# EAGLE design SS (EAGLE 9.3.0)
REVISION: F
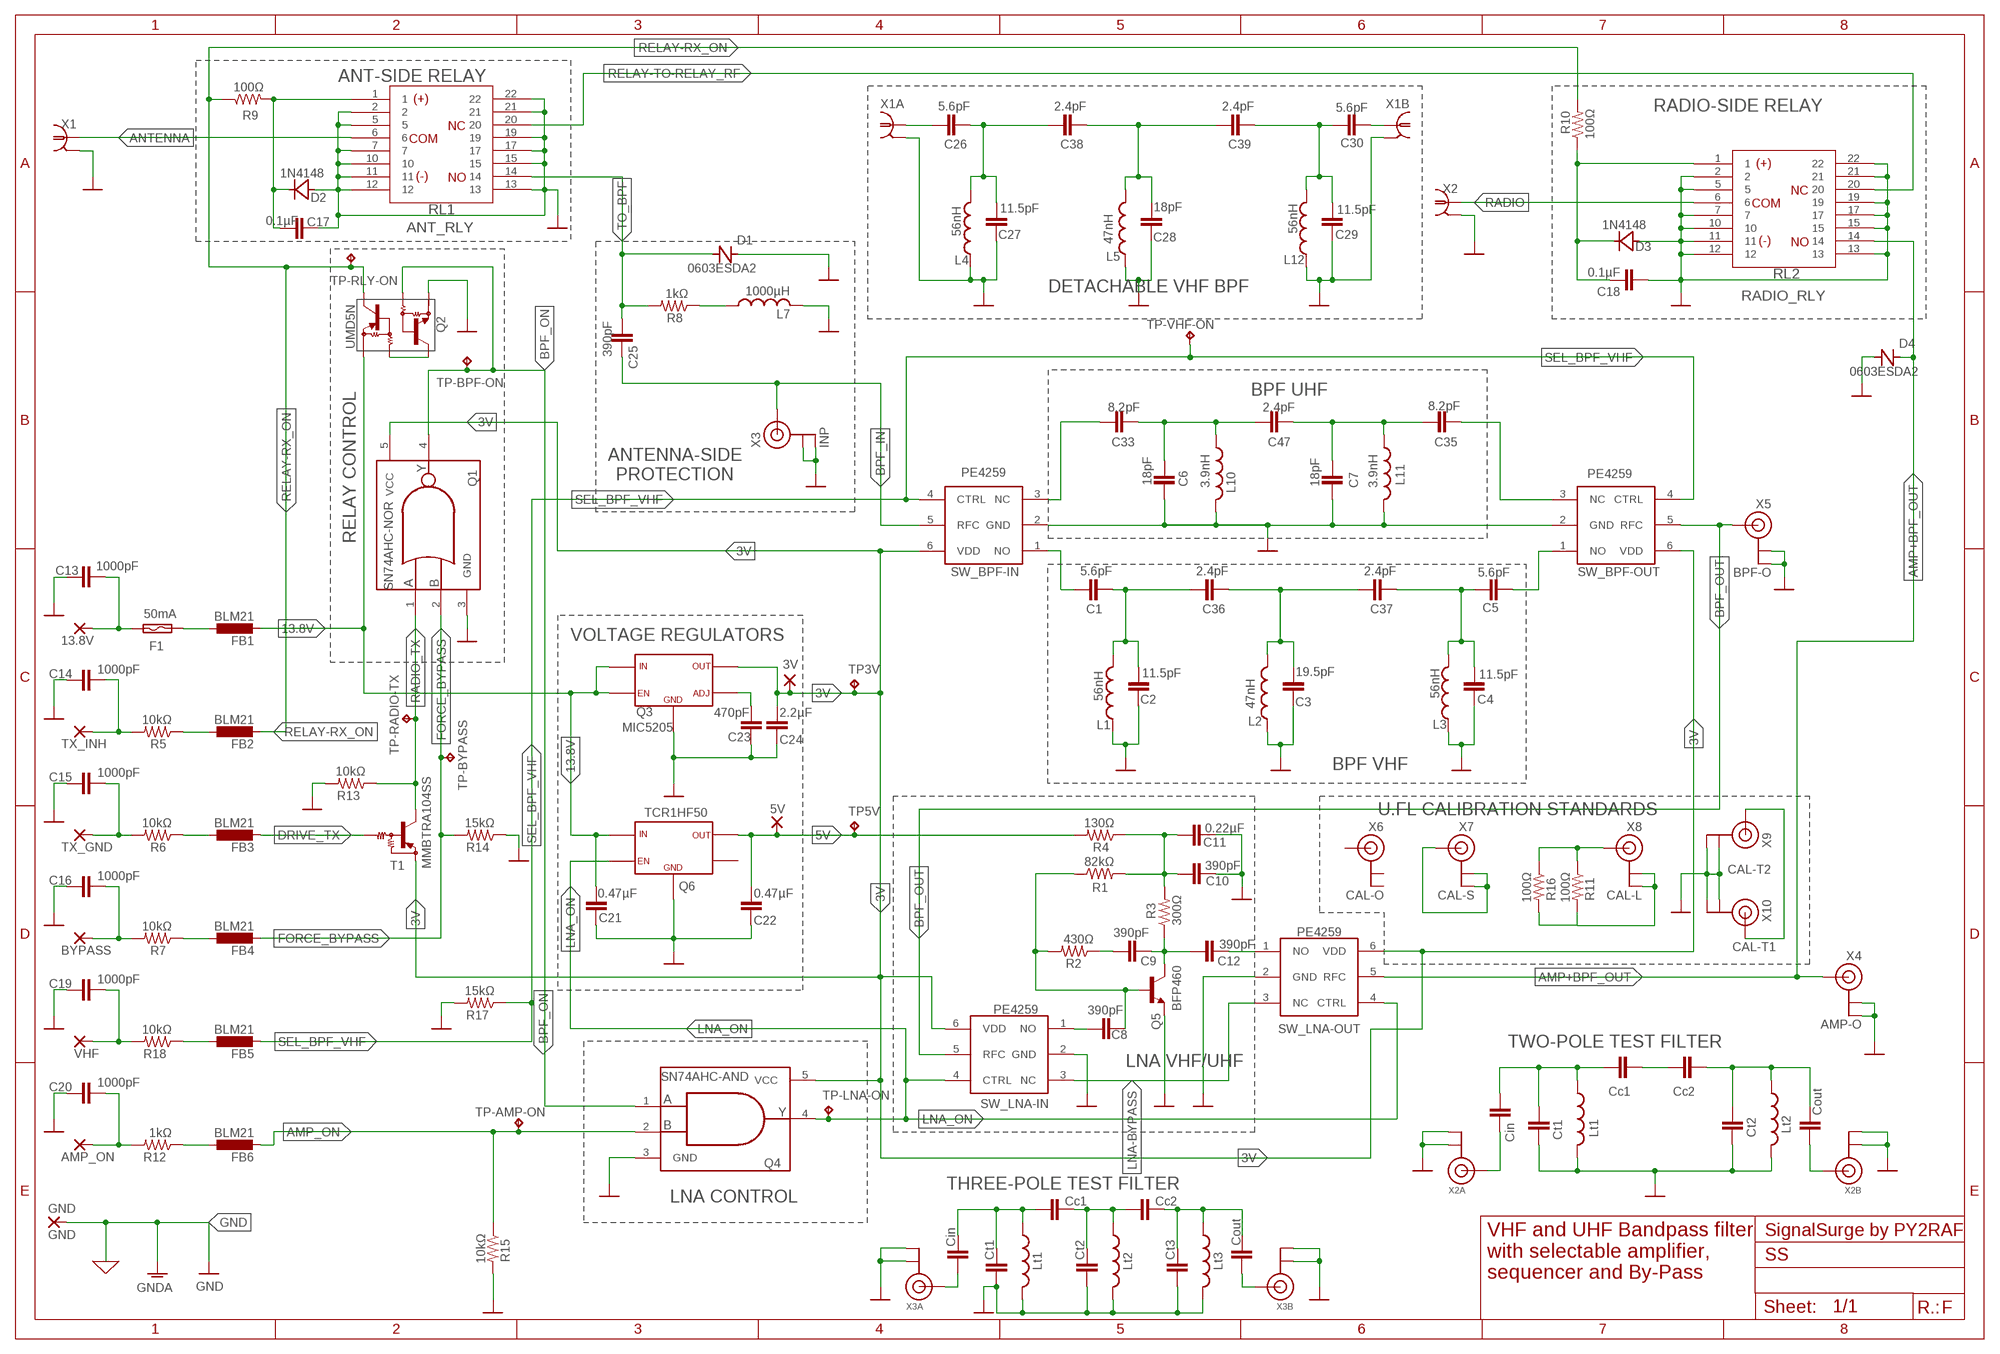
[diagram p0: schematic, sheet 1]

## Parts
3V  3V  JUMPER-1  [JUMPER1]
5V  5V  JUMPER-1  [JUMPER1]
13.8V  13.8V  JUMPER-1  [JUMPER1]
AMP_ON  AMP_ON  JUMPER-1  [JUMPER1]
BYPASS  BYPASS  JUMPER-1  [JUMPER1]
C1  5.6pF  C-0805  [0805]
C2  11.5pF  C-0805  [0805]
C3  19.5pF  C-0805  [0805]
C4  11.5pF  C-0805  [0805]
C5  5.6pF  C-0805  [0805]
C6  18pF  C-0805  [0805]
C7  18pF  C-0805  [0805]
C8  390pF  C-0805  [0805]
C9  390pF  C-0805  [0805]
C10  390pF  C-0805  [0805]
C11  0.22µF  C-0805  [0805]
C12  390pF  C-0805  [0805]
C13  1000pF  C-0805  [0805]
C14  1000pF  C-0805  [0805]
C15  1000pF  C-0805  [0805]
C16  1000pF  C-0805  [0805]
C17  0.1µF  C-0805  [0805]
C18  0.1µF  C-0805  [0805]
C19  1000pF  C-0805  [0805]
C20  1000pF  C-0805  [0805]
C21  0.47µF  C-0805  [0805]
C22  0.47µF  C-0805  [0805]
C23  470pF  C-0805  [0805]
C24  2.2µF  C-0805  [0805]
C25  390pF  C-0805  [0805]
C26  5.6pF  C-0805  [0805]
C27  11.5pF  C-0805  [0805]
C28  18pF  C-0805  [0805]
C29  11.5pF  C-0805  [0805]
C30  5.6pF  C-0805  [0805]
C31  Ct1  C-0805  [0805]
C32  Ct2  C-0805  [0805]
C33  8.2pF  C-0805  [0805]
C35  8.2pF  C-0805  [0805]
C36  2.4pF  C-0805  [0805]
C37  2.4pF  C-0805  [0805]
C38  2.4pF  C-0805  [0805]
C39  2.4pF  C-0805  [0805]
C40  Cin  C-0805  [0805]
C41  Ct1  C-0805  [0805]
C42  Cc1  C-0805  [0805]
C43  Ct2  C-0805  [0805]
C44  Cc2  C-0805  [0805]
C45  Ct3  C-0805  [0805]
C46  Cout  C-0805  [0805]
C47  2.4pF  C-0805  [0805]
D1  0603ESDA2  [0603]
D2  1N4148  D-SOD323  [SOD-323]
D3  1N4148  D-SOD323  [SOD-323]
D4  0603ESDA2  [0603]
F1  50mA  FUSE-1206  [FUSE-1206]
FB1  BLM21  FB-0805  [0805]
FB2  BLM21  FB-0805  [0805]
FB3  BLM21  FB-0805  [0805]
FB4  BLM21  FB-0805  [0805]
FB5  BLM21  FB-0805  [0805]
FB6  BLM21  FB-0805  [0805]
GND  GND  JUMPER-1  [JUMPER1]
L1  56nH  L-0805  [0805]
L2  47nH  L-0805  [0805]
L3  56nH  L-0805  [0805]
L4  56nH  L-0805  [0805]
L5  47nH  L-0805  [0805]
L6  Lt1  L-0805  [0805]
L7  1000µH  L-1207  [1207]
L8  Lt2  L-0805  [0805]
L9  Lt3  L-0805  [0805]
L10  3.9nH  L-0805  [0805]
L11  3.9nH  L-0805  [0805]
L12  56nH  L-0805  [0805]
L13  Cc2  C-0805  [0805]
L14  Cout  C-0805  [0805]
L15  Cin  C-0805  [0805]
L16  Lt1  L-0805  [0805]
L17  Lt2  L-0805  [0805]
L18  Cc1  C-0805  [0805]
Q1  SN74AHC-NOR  [SC70-5]
Q2  UMD5N  [SOT363]
Q3  MIC5205  [SOT23-5]
Q4  SN74AHC-AND  [SC70-5]
Q5  BFP460  [SOT343R]
Q6  TCR1HF50  TCR1HF  [SC-74A]
R1  82kΩ  R-1206  [1206]
R2  430Ω  R-1206  [1206]
R3  300Ω  R-1206  [1206]
R4  130Ω  R-1206  [1206]
R5  10kΩ  R-1206  [1206]
R6  10kΩ  R-1206  [1206]
R7  10kΩ  R-1206  [1206]
R8  1kΩ  R-1206  [1206]
R9  100Ω  R-1206  [1206]
R10  100Ω  R-1206  [1206]
R11  100Ω  R-1206  [1206]
R12  1kΩ  R-1206  [1206]
R13  10kΩ  R-1206  [1206]
R14  15kΩ  R-1206  [1206]
R15  10kΩ  R-1206  [1206]
R16  100Ω  R-1206  [1206]
R17  15kΩ  R-1206  [1206]
R18  10kΩ  R-1206  [1206]
RL1  ANT_RLY  RELAY-TE-HF3  [RELAY-TE-HF3]
RL2  RADIO_RLY  RELAY-TE-HF3  [RELAY-TE-HF3]
SW_BPF-IN  PE4259  [SC-70]
SW_BPF-OUT  PE4259  [SC-70]
SW_LNA-IN  PE4259  [SC-70]
SW_LNA-OUT  PE4259  [SC-70]
T1  MMBTRA104SS  MUN2111T1-PNP_DRIVER-SC59-BEC  [SC59-BEC]
TP3V  TPB1,27  [B1,27]
TP5V  TPB1,27  [B1,27]
TP-AMP-ON  TPB1,27  [B1,27]
TP-BPF-ON  TPB1,27  [B1,27]
TP-BYPASS  TPB1,27  [B1,27]
TP-LNA-ON  TPB1,27  [B1,27]
TP-RADIO-TX  TPB1,27  [B1,27]
TP-RLY-ON  TPB1,27  [B1,27]
TP-VHF-ON  TPB1,27  [B1,27]
TX_GND  TX_GND  JUMPER-1  [JUMPER1]
TX_INH  TX INH  JUMPER-1  [JUMPER1]
VHF  VHF  JUMPER-1  [JUMPER1]
X1  ANTENNA  SMA-PCB  [SMA-RF]
X1A  SMA-EDGE  [SMA-EDGE]
X1B  SMA-EDGE  [SMA-EDGE]
X2  RADIO  SMA-PCB  [SMA-RF]
X2A  ANTENNA_U.FL  [U.FL]
X2B  ANTENNA_U.FL  [U.FL]
X3  INP  ANTENNA_U.FL  [U.FL]
X3A  ANTENNA_U.FL  [U.FL]
X3B  ANTENNA_U.FL  [U.FL]
X4  AMP-O  ANTENNA_U.FL  [U.FL]
X5  BPF-O  ANTENNA_U.FL  [U.FL]
X6  CAL-O  ANTENNA_U.FL  [U.FL]
X7  CAL-S  ANTENNA_U.FL  [U.FL]
X8  CAL-L  ANTENNA_U.FL  [U.FL]
X9  CAL-T2  ANTENNA_U.FL  [U.FL]
X10  CAL-T1  ANTENNA_U.FL  [U.FL]

## Nets
3V: 3V.1(P) C24.P$2 Q1.5(VCC) Q3.5(VOUT) Q4.5(VCC) SW_BPF-IN.6(VDD) SW_BPF-OUT.6(VDD) SW_LNA-IN.6(VDD) SW_LNA-OUT.6(VDD) T1.E TP3V.TP
5V: 5V.1(P) C22.P$2 Q6.5(VOUT) R4.2 TP5V.TP
13.8V: C21.P$2 FB1.P$2 Q2.4 Q3.1(VIN) Q3.3(EN) Q6.1(VIN)
13.8V_IN: 13.8V.1(P) C13.P$2 F1.2
AMP+BPF_OUT [RF_50OHM]: D4.1(A) RL2.14 SW_LNA-OUT.5(RFC) X4.3(SIGNAL)
AMP_ON: FB6.P$2 Q4.2(B) R15.1 TP-AMP-ON.TP
AMP_ON_IN: AMP_ON.1(P) C20.P$2 R12.2
ANTENNA [TX_50OHM]: RL1.6 X1.1
BIAS_IN: C10.P$1 C11.P$1 R1.2 R3.2 R4.1
BLEED: L7.P$1 R8.1
BPF_IN [RF_50OHM]: C25.P$1 SW_BPF-IN.5(RFC) X3.3(SIGNAL)
BPF_ON: Q1.4(Y) Q2.2 Q4.1(A) TP-BPF-ON.TP
BPF_OUT [RF_50OHM]: SW_BPF-OUT.5(RFC) SW_LNA-IN.5(RFC) X5.3(SIGNAL)
BYPASS_SEL_IN: BYPASS.1(P) C16.P$2 R7.2
D-V-IN [RF_50OHM]: C30.P$2 X1B.P$3
D-V-OUT [RF_50OHM]: C26.P$2 X1A.P$3
D-V-P1 [RF_50OHM]: C26.P$1 C27.P$1 C38.P$2 L4.P$2
D-V-P2 [RF_50OHM]: C28.P$1 C38.P$1 C39.P$2 L5.P$2
D-V-P3 [RF_50OHM]: C29.P$1 C30.P$1 C39.P$1 L12.P$1
DRIVE_TX: FB3.P$2 T1.B
FEED-RA: C17.P$2 D2.C R9.2 RL1.1
FEED-RB: C18.P$1 D3.C R10.1 RL2.1
FORCE_BYPASS: FB4.P$2 Q1.2(B) R14.2 TP-BYPASS.TP
GND: C2.P$2 C3.P$2 C4.P$2 C6.P$1 C7.P$1 C10.P$2 C11.P$2 C13.P$1 C14.P$1 C15.P$1 C16.P$1 C17.P$1 C18.P$2 C19.P$1 C20.P$1 C21.P$1 C22.P$1 C23.P$1 C24.P$1 C27.P$2 C28.P$2 C29.P$2 C31.P$1 C32.P$1 C41.P$2 C43.P$2 C45.P$2 D1.1(A) D2.A D3.A D4.2(C) GND.1(P) L1.P$1 L2.P$1 L3.P$2 L4.P$1 L5.P$1 L6.P$2 L7.P$2 L8.P$2 L9.P$2 L10.P$2 L11.P$2 L12.P$2 L16.P$2 L17.P$2 Q1.3(GND) Q2.1 Q3.2(GND) Q4.3(GND) Q5.1(E) Q5.3(E) Q6.2(GND) R13.2 R14.1 R15.2 R17.2 RL1.2 RL1.5 RL1.7 RL1.10 RL1.11 RL1.12 RL1.13 RL1.15 RL1.17 RL1.19 RL1.21 RL1.22 RL2.2 RL2.5 RL2.7 RL2.10 RL2.11 RL2.12 RL2.13 RL2.15 RL2.17 RL2.19 RL2.21 RL2.22 SW_BPF-IN.2(GND) SW_BPF-OUT.2(GND) SW_LNA-IN.2(GND) SW_LNA-OUT.2(GND) X1.2 X1.3 X1.4 X1.5 X1A.P$1 X1A.P$2 X1A.P$4 X1A.P$5 X1A.P$6 X1A.P$7 X1B.P$1 X1B.P$2 X1B.P$4 X1B.P$5 X1B.P$6 X1B.P$7 X2.2 X2.3 X2.4 X2.5 X2A.1(GND) X2A.2(GND) X2B.1(GND) X2B.2(GND) X3.1(GND) X3.2(GND) X3A.1(GND) X3A.2(GND) X3B.1(GND) X3B.2(GND) X4.1(GND) X4.2(GND) X5.1(GND) X5.2(GND) X9.1(GND) X9.2(GND) X10.1(GND) X10.2(GND) ; supply symbol labelled GNDA
LNA-BYPASS [RF_50OHM]: SW_LNA-IN.3(NC) SW_LNA-OUT.3(NC)
LNA-IN: C8.P$2 Q5.4(B) R1.1 R2.2
LNA-OUT: C9.P$2 C12.P$1 Q5.2(C) R3.1
LNA_ON: Q4.4(Y) Q6.3(EN) SW_LNA-IN.4(CTRL) SW_LNA-OUT.4(CTRL) TP-LNA-ON.TP
N$1: C12.P$2 SW_LNA-OUT.1(NO)
N$3: C8.P$1 SW_LNA-IN.1(NO)
N$4: C23.P$2 Q3.4(ADJ-BYP)
N$5 [RF_50OHM]: L13.P$1 L18.P$2
N$6 [RF_50OHM]: L15.P$1 X2A.3(SIGNAL)
N$7: Q2.5 Q2.6
N$8 [RF_50OHM]: X7.1(GND) X7.2(GND) X7.3(SIGNAL)
N$9 [RF_50OHM]: R11.1 R16.1 X8.3(SIGNAL)
N$10: R11.2 R16.2 X8.1(GND) X8.2(GND)
N$11 [RF_50OHM]: L14.P$2 X2B.3(SIGNAL)
N$12: FB5.P$1 R18.1
N$13: F1.1 FB1.P$1
N$14 [RF_50OHM]: X9.3(SIGNAL) X10.3(SIGNAL)
N$22: C9.P$1 R2.1
N$27: FB2.P$1 R5.1
N$28: FB3.P$1 R6.1
N$32: FB4.P$1 R7.1
N$45: FB6.P$1 R12.1
RADIO [TX_50OHM]: RL2.6 X2.1
RADIO_TX: Q1.1(A) R13.1 T1.C TP-RADIO-TX.TP
RELAY-RX_ON: FB2.P$2 Q2.3 R9.1 R10.2 TP-RLY-ON.TP
RELAY-TO-RELAY_RF [TX_50OHM]: RL1.20 RL2.20
SEL_BPF_VHF: FB5.P$2 R17.1 SW_BPF-IN.4(CTRL) SW_BPF-OUT.4(CTRL) TP-VHF-ON.TP
T-U-IN [RF_50OHM]: C40.P$1 X3A.3(SIGNAL)
T-U-OUT [RF_50OHM]: C46.P$1 X3B.3(SIGNAL)
T-U-P1 [RF_50OHM]: C40.P$2 C41.P$1 C42.P$1 L6.P$1
T-U-P2 [RF_50OHM]: C42.P$2 C43.P$1 C44.P$1 L8.P$1
T-U-P3 [RF_50OHM]: C44.P$2 C45.P$1 C46.P$2 L9.P$1
T-V-P1 [RF_50OHM]: C31.P$2 L15.P$2 L16.P$1 L18.P$1
T-V-P2 [RF_50OHM]: C32.P$2 L13.P$2 L14.P$1 L17.P$1
TO_BPF [RF_50OHM]: C25.P$2 D1.2(C) R8.2 RL1.14
TX_GND_IN: C15.P$2 R6.2 TX_GND.1(P)
TX_INH_OUT: C14.P$2 R5.2 TX_INH.1(P)
UHF-IN [RF_50OHM]: C33.P$1 SW_BPF-IN.3(NC)
UHF-OUT [RF_50OHM]: C35.P$2 SW_BPF-OUT.3(NC)
UHF-P1 [RF_50OHM]: C6.P$2 C33.P$2 C47.P$1 L10.P$1
UHF-P2 [RF_50OHM]: C7.P$2 C35.P$1 C47.P$2 L11.P$1
VHF-IN [RF_50OHM]: C1.P$2 SW_BPF-IN.1(NO)
VHF-OUT [RF_50OHM]: C5.P$2 SW_BPF-OUT.1(NO)
VHF-P1 [RF_50OHM]: C1.P$1 C2.P$1 C36.P$2 L1.P$2
VHF-P3 [RF_50OHM]: C4.P$1 C5.P$1 C37.P$1 L3.P$1
VHF_ON_IN: C19.P$2 R18.2 VHF.1(P)
VPF-P2 [RF_50OHM]: C3.P$1 C36.P$1 C37.P$2 L2.P$2
Unconnected: Q6.4(NC) X6.1(GND) X6.2(GND) X6.3(SIGNAL)

## Notes on the sheet
- ANT-SIDE RELAY
- RADIO-SIDE RELAY
- DETACHABLE VHF BPF
- BPF UHF
- ANTENNA-SIDE
  PROTECTION
- RELAY CONTROL
- VOLTAGE REGULATORS
- BPF VHF
- U.FL CALIBRATION STANDARDS
- TWO-POLE TEST FILTER
- LNA VHF/UHF
- THREE-POLE TEST FILTER
- LNA CONTROL
- VHF and UHF Bandpass filter
  with selectable amplifier,
  sequencer and By-Pass
- SignalSurge by PY2RAF
- R.:

## Library data of the parts
3V 5V AMP_ON BYPASS GND TX_GND VHF = aarf:JUMPER-1
13.8V TX_INH = aarf:JUMPER-1; SPICEPREFIX: X
C1-C33 C35-C47 L13-L15 L18 = aarf:C-0805
D1 D4 = aarf:0603ESDA2: 0603ESDA2-TR2 • Lead free, halogen free materials • 0603/1608 footprint surface mount device • Ideal ESD protection for high frequency, low voltage applications • Exceeds testing requirements of IEC 61000-4-2 • Ultra low capacitance (0.15pF maximum) • Very low leakage current • Fast response time • Bi-directional
D2 D3 = aarf:D-SOD323: Diode - SOD323
F1 = aarf:FUSE-1206; SPICEPREFIX: B
FB1-FB6 = aarf:FB-0805: Ferrite Bead - 0805
L1-L6 L8-L12 L16 L17 = aarf:L-0805: Inductor - L - Footprint 0805
L7 = aarf:L-1207: Tayo 1207/3218 Inductor
Q1 = aarf:SN74AHC-NOR: SN74AHC1G32
Q2 = aarf:UMD5N
Q3 = aarf:MIC5205
Q4 = aarf:SN74AHC-AND: 2-input AND gate SN74AHC1G32
Q5 = aarf:BFP460: Infineon BFP460 - NPN LNA
Q6 = aarf:TCR1HF
R1-R18 = aarf:R-1206
RL1 RL2 = aarf:RELAY-TE-HF3; IMPEDANCE: 50R
SW_BPF-IN SW_BPF-OUT SW_LNA-IN SW_LNA-OUT = aarf:PE4259: PE4259 SPDT High Power UltraCMOS 10 MHz 3.0 GHz RF Switch Features - High ESD tolerance of 2 kV HBM - Single-pin or complementary CMOS logic control inputs - Low insertion loss: * 0.35 dB @ 1000 MHz * 0.5 dB @ 2000 MHz - Isolation of 30 dB @ 1000 MHz - Typical input 1 dB compression point of +33.5 dBm - 1.8V minimum power supply voltage - Ultra-small SC-70 package
T1 = transistor:*-PNP_DRIVER-: PNP Bias Resistor Transistor
TP3V TP5V TP-AMP-ON TP-BPF-ON TP-BYPASS TP-LNA-ON TP-RADIO-TX TP-RLY-ON TP-VHF-ON = testpad:TP: Test pad
X1 X2 = aarf:SMA-PCB
X1A X1B = aarf:SMA-EDGE: SMA Edge adapter Datasheet: Samtec SMA-J-P-X-ST-EM1 Part: RF2-145A-T-17-50-G-HDW
X2A X2B X3 X3A X3B X4-X10 = adafruit:ANTENNA_U.FL: U.FL Antenna Connector

## Net classes
1 RF_50OHM: width 1 mm, clearance 0.254 mm
2 TX_50OHM: width 1.5 mm, clearance 0.5 mm

## Board
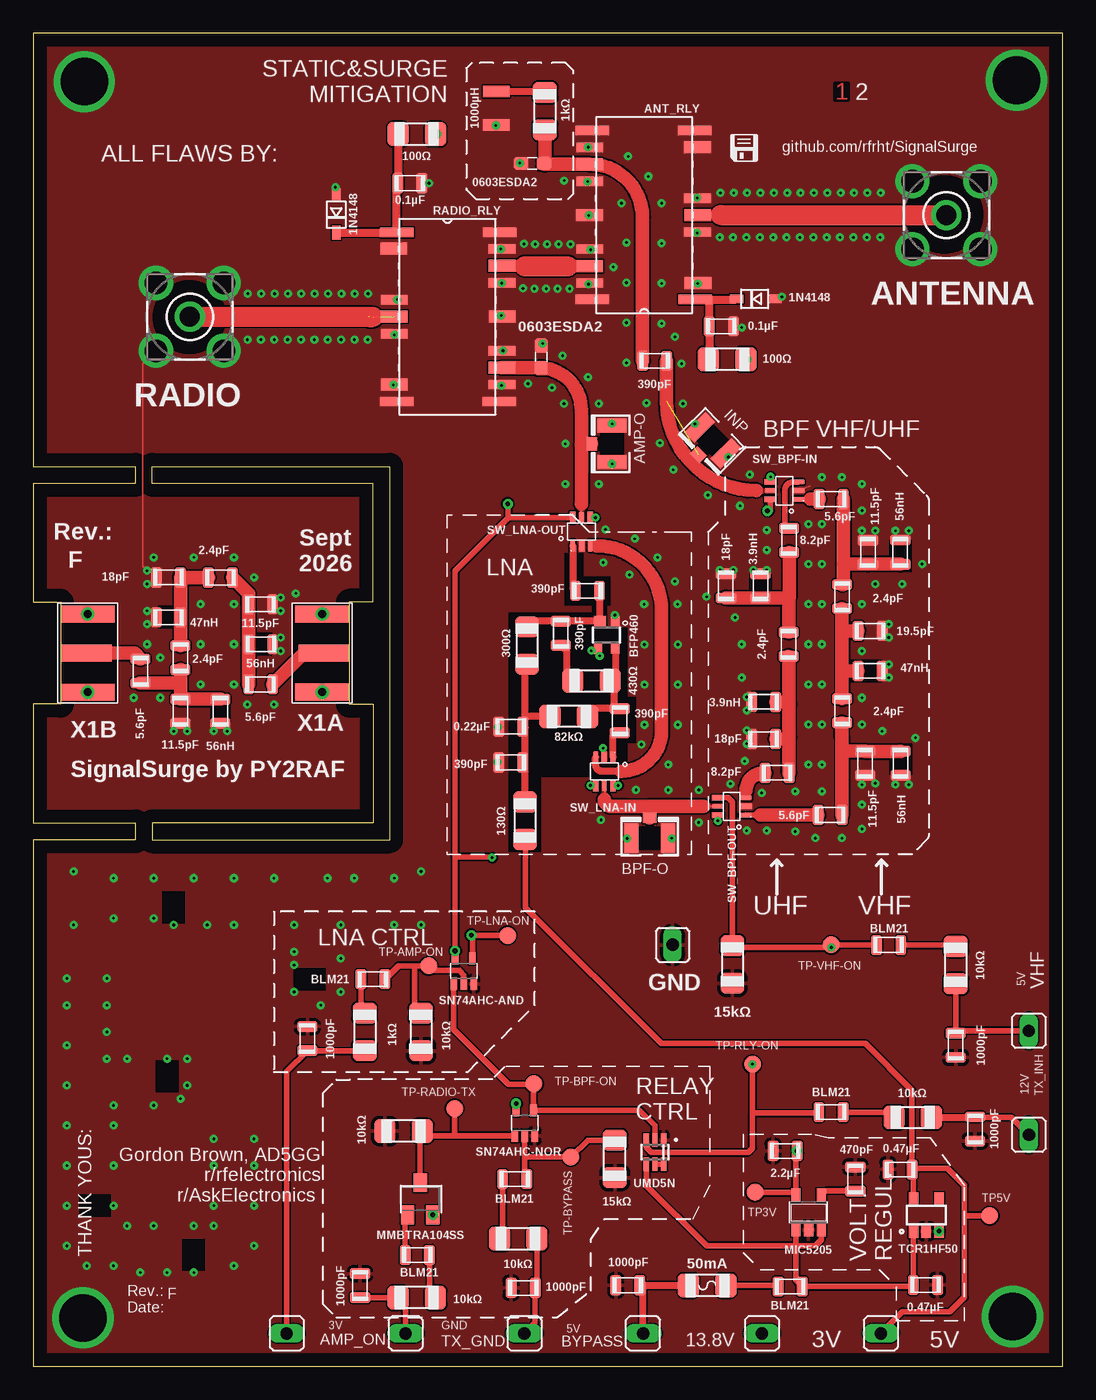
[diagram p1: board, top side]
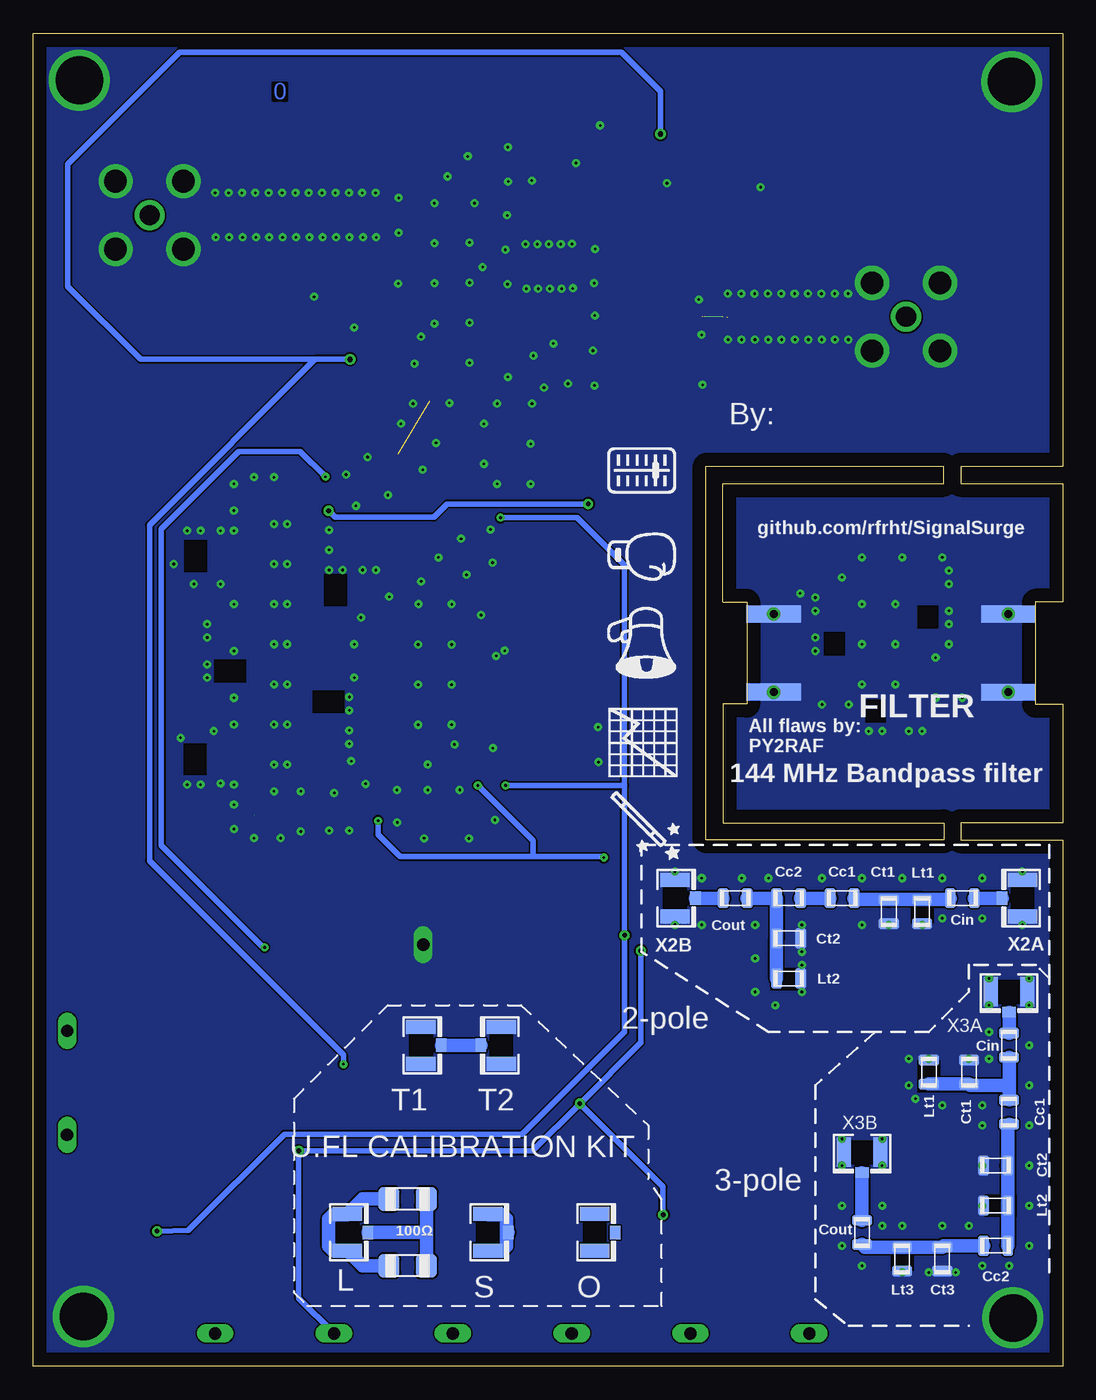
[diagram p2: board, bottom side, seen from below]

Size 77 x 99.7 mm. Coordinates in mm from the lower left corner, seen from the top.
Outline: 0,0 77,0 77,99.7 0,99.7 0,67.31 7.62,67.31 7.62,66.04 0,66.04 0,57.15 2.03,57.15 2.03,49.53 0,49.53 0,40.64 7.62,40.64 7.62,39.37 0,39.37 0,0
Outline: 8.89,67.31 26.67,67.31 26.67,39.37 8.89,39.37 8.89,40.64 25.4,40.64 25.4,49.53 23.62,49.53 23.62,57.15 25.4,57.15 25.4,66.04 8.89,66.04 8.89,67.31
Copper layers (1*16): Top 0.035mm / dielectric 1.5mm / Bottom 0.035mm
Design rules "default *": minimum track width 4mil, minimum drill 0.15mm, track to track 5mil, track to pad 5mil, pad to pad 6mil, via to via 6mil, smd to smd 6mil, copper to edge 40mil, drill to drill 0.45mm, minimum pad ring 0.2mm, minimum via ring 0.2mm, stop-mask expansion 4mil, vias tented up to drill 0mil, thermal gap 10mil
tRestrict: area 65.7,83.7 to 70.6,88.6; area 9.4,76.2 to 13.9,80.7; area 35.6,44.1 to 44.5,55.2; area 35.6,55.2 to 42.9,56.4; area 44.5,46.6 to 45.1,50; area 39.8,58.8 to 41.1,60.8; area 41.8,56.4 to 42.9,57.1; area 39.8,56.9 to 43.2,59.1; area 35.6,38.5 to 38,44.1; area 64,59.4 to 65.7,61.8; area 61.1,51.1 to 63.5,52.8; area 64,44.2 to 65.7,46.6; 10 more areas
bRestrict: area 64,59.4 to 65.7,61.8; area 61.1,51.1 to 63.5,52.8; area 64,44.2 to 65.7,46.6; area 53.7,48.8 to 56.1,50.5; area 53.5,56.9 to 55.2,59.3; area 19.5,28.1 to 21.9,29.8; area 9.6,33.1 to 11.3,35.5; area 9.2,20.5 to 10.9,22.9; area 3.4,11.2 to 5.8,12.9; area 11.1,7.1 to 12.8,9.5; area 9.3,55.2 to 10.9,56.9; area 16.3,53.2 to 17.9,54.9; 1 more areas

### Footprints (pad centres in the part's own frame; a part is rotated, then mirrored left to right if it is on the bottom)
JUMPER1 = drill 0.914 long: 1 0,0
0805 = smd 0.8 x 1.5: P$1 -0.9,0; P$2 0.9,0
0603 = smd 1.1 x 1: 1 -0.85,0; 2 0.85,0
SOD-323 = smd 1.016 x 0.635: A 1.481,0; C -1.354,0
FUSE-1206 = smd 1.6 x 1.8: 1 -1.4,0; 2 1.4,0
1207 = smd 0.85 x 2: P$1 -1.251,-0.016; P$2 1.249,-0.016
SC70-5 = smd 0.5 x 0.9: 1 -0.75,-0.95; 2 0,-0.95; 3 0.75,-0.95; 4 0.65,0.95; 5 -0.65,0.95
SOT363 = smd 0.4 x 1: 1 -0.65,-0.9; 2 0,-0.9; 3 0.65,-0.9; 4 0.65,0.9; 5 0,0.9; 6 -0.65,0.9
SOT23-5 = smd 0.69 x 0.99: 1 0.95,1.29; 2 0,1.29; 3 -0.95,1.29; 4 -0.95,-1.3; 5 0.95,-1.3
SOT343R = smd 0.8 x 0.6: 1 1.027,-0.65; 3 -1.027,0.65; 4 -1.002,-0.65 | smd 0.8 x 0.9: 2 1.027,0.5
SC-74A = smd 0.7 x 1: 1 -0.95,-1.2; 2 0,-1.2; 3 0.95,-1.2; 4 0.95,1.2; 5 -0.95,1.2
1206 = smd 1.6 x 1.8: 1 -1.4,0; 2 1.4,0
RELAY-TE-HF3 = smd 2.5 x 0.7: 1 -3.8,6.3; 11 -3.783,-6.348; 12 3.883,-6.348; 22 3.9,6.3 | smd 2 x 0.9: 2 -4.01,5.082; 6 -4,0; 10 -3.975,-5.077; 14 4.083,-3.808; 17 4.1,0; 20 4.083,3.812 | smd 2 x 0.7: 5 -3.983,1.272; 7 -3.983,-1.268; 13 4.083,-5.077; 15 4.083,-2.538; 19 4.083,2.542; 21 4.083,5.082
SC-70 = smd 0.4 x 0.9: 1 -0.635,-1.035; 2 0.015,-1.035; 3 0.665,-1.035; 4 0.665,1.065; 5 0.015,1.065; 6 -0.635,1.065
SC59-BEC = smd 1 x 1.4: B -0.95,-1.2; C 0,1.2; E 0.95,-1.2
B1,27 = smd 1.27 x 1.27: TP 0,0
SMA-RF = drill 1.5: 1 0,0 | drill 1.7: 2 -2.54,2.54; 3 2.54,2.54; 4 2.54,-2.54; 5 -2.54,-2.54
SMA-EDGE = smd 1.27 x 4.064: P$1 -2.913,0.254; P$2 2.929,0.254 | smd 1.27 x 3.81: P$3 0,0.127 | smd 1.27 x 4.064 bottom: P$4 -2.913,0.254; P$5 2.929,0.254 | drill 0.6: P$6 -2.921,0.254; P$7 2.921,0.254
U.FL = smd 2.2 x 1.05: 1 0,1.375; 2 0,-1.375 | smd 0.8 x 1: 3 1.525,0

### Placement (x,y rotation side)
3V  54.51,2.44 0 top
5V  63.4,2.44 0 top
13.8V  45.62,2.44 180 top
AMP_ON  18.95,2.44 0 top
BYPASS  36.73,2.44 0 top
C1  59.7,64.86 180 top
C2  62.43,60.89 90 top
C3  62.6,55 0 top
C4  62.23,45.1 270 top
C5  59.6,41.23 180 top
C6  51.81,58.36 270 top
C7  54.64,46.92 0 top
C8  43.87,48.28 90 top
C9  39.45,54.81 90 top
C10  35.71,45.15 180 top
C11  35.71,47.83 180 top
C12  41.45,57.99 180 top
C13  44.48,6.05 0 top
C14  70.45,17.74 90 top
C15  24.44,6.02 270 top
C16  36.64,5.86 0 top
C17  51.47,77.79 180 top
C18  28.17,88.5 0 top
C19  69,24 90 top
C20  20.5,24.5 270 top
C21  66.74,6.07 180 top
C22  64.84,14.71 0 top
C23  61.5,14 270 top
C24  56.24,16.1 0 top
C25  46.48,75.2 180 top
C26  17,51 0 top
C27  17,57 0 top
C28  10.1,59 180 top
C29  11,49 270 top
C30  8,52 90 top
C31  13,34 90 bottom
C32  20.5,32 180 bottom
C33  56.55,61.77 270 top
C35  55.64,44.37 180 top
C36  60.5,57.57 90 top
C37  60.5,49.03 90 top
C38  14,59 0 top
C39  11,53 90 top
C40  4,24 270 bottom
C41  7,22 90 bottom
C42  4,19 270 bottom
C43  5,15 180 bottom
C44  5,9 180 bottom
C45  9,8 270 bottom
C46  15,10 270 bottom
C47  56.5,54 270 top
D1  37.33,89.97 0 top
D2  53.96,79.83 0 top
D3  22.66,86.15 90 top
D4  38,75.5 90 top
F1  50.41,6.04 180 top
FB1  56.62,5.96 0 top
FB2  59.67,19 180 top
FB3  28.72,8.31 180 top
FB4  36,14 0 top
FB5  64,31.5 180 top
FB6  25.4,28.94 0 top
GND  47.83,31.52 90 top
L1  64.86,60.9 270 top
L2  62.6,52 180 top
L3  64.89,45.1 270 top
L4  17,54 180 top
L5  10.1,56.03 0 top
L6  10,22 90 bottom
L7  34.64,94.11 270 top
L8  5,12 180 bottom
L9  12,8 270 bottom
L10  54.39,58.36 90 top
L11  54.64,49.68 180 top
L12  14,49 270 top
L13  20.5,35 180 bottom
L14  24.5,35 180 bottom
L15  7.5,35 180 bottom
L16  10.5,34 270 bottom
L17  20.5,29 0 bottom
L18  16.5,35 180 bottom
Q1  36.76,18.19 0 top
Q2  46.5,16 180 top
Q3  58,11.5 180 top
Q4  32.19,29.56 0 top
Q5  42.88,54.7 90 top
Q6  66.8,11.3 0 top
R1  40.06,48.59 180 top
R2  41.75,51.26 0 top
R3  36.93,53.9 270 top
R4  36.78,40.8 270 top
R5  65.79,18.61 0 top
R6  28.68,5.12 180 top
R7  36.27,9.53 0 top
R8  38.27,93.88 270 top
R9  51.91,75.32 180 top
R10  28.68,92.17 0 top
R11  49,12.5 180 bottom
R12  24.78,25.01 270 top
R13  27.7,17.58 180 top
R14  43.5,15.5 90 top
R15  29,25 270 top
R16  49,7.5 180 bottom
R17  52.3,30.05 270 top
R18  69,30 270 top
RL1  45.7,86.1 180 top
RL2  30.98,78.5 0 top
SW_BPF-IN  56.22,65.48 90 top
SW_BPF-OUT  52.28,41.86 90 top
SW_LNA-IN  42.73,44.51 180 top
SW_LNA-OUT  41,62.41 0 top
T1  28.94,12.52 0 top
TP3V  54,13 180 top
TP5V  71.56,11.25 0 top
TP-AMP-ON  29.57,29.95 0 top
TP-BPF-ON  37.44,21.12 0 top
TP-BYPASS  40.22,15.64 0 top
TP-LNA-ON  35.49,32.21 0 top
TP-RADIO-TX  31.52,19.28 0 top
TP-RLY-ON  53.8,22.58 0 top
TP-VHF-ON  59.7,31.52 0 top
TX_GND  27.84,2.44 0 top
TX_INH  74.48,17.3 270 top
VHF  74.48,25.07 270 top
X1  68.31,86.1 0 top
X1A  21.86,53.34 90 top
X1B  3.81,53.34 270 top
X2  11.71,78.5 0 top
X2A  3,35 180 bottom
X2B  29,35 0 bottom
X3  50.83,69.26 225 top
X3A  4,28 270 bottom
X3B  15,16 270 bottom
X4  43.29,69 180 top
X5  46.11,39.5 90 top
X6  35,10 0 bottom
X7  43,10 0 bottom
X8  53.5,10 0 bottom
X9  48,24 0 bottom
X10  42,24 180 bottom

### Tracks (layer width: path | path; a pad name or v marks a point on that pad's centre or on a via)
3V  (via drill 0.2, 0.25, 0.35)  (1 unrouted)
  Top 0.406: v43.75,43.44 43.37,43.44 SW_LNA-IN.6 | v51.21,40.8 SW_BPF-OUT.6 | Q1.5 36.11,19.62 v36.12,19.64 | v31.55,31.07 Q4.5 31.54,38.1 | 31.54,38.1 31.54,59.48 35.5,63.44 | 57.35,15.94 57.25,16.04 57.05,15.84 57.05,13 | SW_BPF-IN.6 55.15,63.98 v54.92,63.98 | v35.5,64.5 35.5,63.44 | SW_LNA-OUT.6 35.53,63.48 35.5,63.44 | v34.32,38.04 34.26,38.1 31.54,38.1 | Q3.5 57.05,13 | TP3V.TP 57.05,13
  Top 0.5: 57.25,16.04 C24.P$2
  Bottom 0.406: v36.12,19.64 39.66,16.1 C24.P$2 57.14,5.07 3V.1 | v36.12,19.64 31.55,24.21 v31.55,31.07 | v43.75,43.44 39.63,39.31 39.63,38.13 39.62,38.13 | v51.21,40.8 51.21,39.78 49.56,38.13 39.62,38.13 | T1.E 29.89,13.4 v36.12,19.64 | v34.32,38.04 34.4,38.13 39.62,38.13 | v54.92,63.98 54.44,63.5 47.04,63.5 46.04,64.5 v35.5,64.5
  other vias: 57.14,16.1 29.89,11.32 54.51,2.44
5V
  Top 0.406: Q6.5 65.85,14.71 C22.P$2 | 69.65,11.23 69.65,13.54 68.38,14.81 65.84,14.81 C22.P$2 | TP5V.TP 69.67,11.25 69.65,11.23 | 5V.1 65.02,4.06 68.58,4.06 69.65,5.13 69.65,11.23 | C22.P$2 65.74,20.62 62.23,24.13 46.99,24.13 36.83,34.29 36.83,39.35 R4.2
13.8V
  Top 0.406: Q6.1 65.84,10.09 C21.P$2 65.73,5.96 FB1.P$2 57.05,6.43 57.05,9 | Q3.1 57.05,9 | Q3.3 58.95,9.45 58.5,9 57.05,9 | Q2.4 45.85,13.54 50.38,9 57.05,9
13.8V_IN
  Top 0.508: 13.8V.1 45.62,5.81 C13.P$2 48.98,6.05 F1.2
AMP+BPF_OUT
  Top 0.152: SW_LNA-OUT.5 41.01,64.49 arc90 41,64.5 | D4.1 38.04,74.69
  Top 1: RL2.14 37.81,74.69 | 37.81,74.69 38.04,74.69 | 37.81,74.69 arc-90 41,71.5 41,68.94 | 41,68.94 41,64.5 | X4.3 41,68.94
  pour Top (no thermals): 40.87,63.88 40.59,64.49 41.45,64.49 41.15,63.88
AMP_ON
  Top 0.406: Q4.2 32.19,29.28 31.88,29.59 29.93,29.59 TP-AMP-ON.TP 28.5,29.95 | 28.5,29.95 27.31,29.95 FB6.P$2 | R15.1 28.5,26.9 28.5,29.95
AMP_ON_IN
  Top 0.406: AMP_ON.1 18.95,22.05 C20.P$2 R12.2
ANTENNA
  Top 0.15: RL1.6 51.44,86.11
  Top 1.5: 51.44,86.11 X1.1
  pour Top (no thermals): 50.67,86.46 51.36,86.77 51.36,85.45 50.7,85.72
BIAS_IN
  Top 0.508: R4.1 36.78,44.45 | 36.78,44.45 36.78,47.75 | 36.78,47.75 36.78,48.64 | 36.78,48.64 36.78,52.35 R3.2 | C10.P$1 36.61,44.62 36.78,44.45 | C11.P$1 36.71,47.83 36.78,47.75 | R1.2 36.83,48.59 36.78,48.64
BLEED
  Top 0.508: L7.P$1 38.19,95.36 R8.1
BPF_IN  (1 unrouted)
  Top 1: C25.P$1 47.38,72.21 arc90 54.08,65.51
  pour Top (no thermals): 54.74,65.38 54.08,65.07 54.08,65.91 54.74,65.63
BPF_ON
  Top 0.406: 37.41,21.09 Q1.4 45.36,19.14 46.5,18 Q2.2 | 37.41,21.09 TP-BPF-ON.TP 37.4,21.08 35.56,21.08 31.44,25.2 Q4.1 | 37.41,21.09
BPF_OUT
  Top 0.152: SW_LNA-IN.5 42.72,42.4 arc90 42.72,42.39 | SW_BPF-OUT.5 50.15,41.87
  Top 1: 44.28,41.88 44.29,41.87 | 44.29,41.87 46.13,41.87 | 50.15,41.87 46.13,41.87 | 44.29,41.87 43.24,41.87 arc-90 42.72,42.39 | X5.3 46.11,41.85 46.13,41.87
  pour Top (no thermals): 50.8,42.01 50.22,42.29 50.22,41.45 50.83,41.73 50.83,41.99
  pour Top (no thermals): 42.6,43.05 42.29,42.47 43.15,42.47 42.88,43.05
BYPASS_SEL_IN
  Top 0.406: R7.2 37.67,5.94 | BYPASS.1 37.54,3.25 C16.P$2
  Top 0.5: 37.67,5.94 C16.P$2
D-V-IN
  Top 1: X1B.P$3 7.56,53.34 C30.P$2
D-V-OUT
  Top 0.508: X1A.P$3
  Top 1: X1A.P$3 20.24,53.34 C26.P$2
D-V-P1
  Top 1: C38.P$2 16.1,57.8 C27.P$1 L4.P$2 C26.P$1
D-V-P2
  Top 1: C38.P$1 C28.P$1 L5.P$2 C39.P$2
D-V-P3
  Top 1: 11,51 C29.P$1 L12.P$1 | 11,51 C39.P$1 | C30.P$1 10.9,51.1 11,51
DRIVE_TX
  Top 0.406: FB3.P$2 27.82,11.15 T1.B
FEED-RA
  Top 0.61: RL1.1 50.5,79.8 | 50.5,79.8 52.57,79.8 D2.C | 50.5,79.8 50.57,79.73 C17.P$2 50.57,75.39 R9.2
FEED-RB
  Top 0.61: D3.C RL2.1 27.18,88.46 | 27.18,88.46 C18.P$1 | R10.1 27.28,88.56 27.18,88.46
FORCE_BYPASS
  Top 0.406: Q1.2 36.76,15.5 | 36.76,15.5 36.76,14.14 FB4.P$2 | R14.2 41.48,16.9 TP-BYPASS.TP 36.9,15.64 36.76,15.5
GND  (via drill 0.2, 0.6, 3.56)
  Top 0.102: X2.5 8.17,74.96 8.17,59.83 v8.5,59.5
  Top 0.127: SW_BPF-IN.2 58.09,65.84
  Top 0.152: SW_LNA-IN.2 42.72,46.15 v42.63,46.23
  Top 0.406: 35.68,81.04 RL2.19 | 35.85,83.58 RL2.21
  Top 0.508: v41.74,53.52 42.08,53.52 Q5.3 | 35.86,84.8 RL2.22 | 35.21,83.57 v34.97,83.57 | 41.37,83.52 v41.69,83.52 | 41.78,79.78 RL1.22 | 35.36,81.02 v35.05,81.02
  other vias: 47.83,31.52 43.3,67.5 43.3,70.5 34.6,92.81 36.4,90 44.42,39.47 47.77,39.49 36.71,83.96 37.55,83.93 38.44,83.93 39.3,83.93 40.19,83.93 42.37,53.14 38.8,73.2 39.6,75.6 43.39,82.22 43.52,56.19 73.26,3.71 3.71,3.61 3.81,96.1 73.56,96.2 39.71,88.7 27.22,79.79 27,77.15 35,78.59 35.13,75.97 35.02,73.36 41.53,80.94 41.47,88.62 41.5,91.18 49.66,87.39 49.66,84.78 49.7,80.99 41.55,86.09 26.93,73.41 58,63 60.5,39.5 54.5,42.88 54.87,40.06 57,40 58.5,39.5 16.05,80.24 17.05,80.24 18.05,80.24 19.05,80.24 20.05,80.24 21.05,80.24 22.05,80.24 23.05,80.24 24.05,80.24 25.05,80.24 16.02,76.79 17.02,76.79 18.02,76.79 19.02,76.79 20.02,76.79 21.02,76.79 22.02,76.79 23.02,76.79 24.02,76.79 25.02,76.79 55.4,87.77 56.4,87.77 57.4,87.77 58.4,87.77 59.4,87.77 60.4,87.77 61.4,87.77 62.4,87.77 63.4,87.77 54.35,84.44 55.35,84.44 56.35,84.44 57.35,84.44 58.35,84.44 59.35,84.44 60.35,84.44 61.35,84.44 62.35,84.44 63.35,84.44 54.4,87.77 53.4,87.77 52.4,87.77 51.4,87.77 53.35,84.44 52.35,84.44 51.35,84.44 16.5,59 18.5,57.5 15,60.5 15,54 15,57 12.5,57 15,51 8.5,58.5 8.5,56.5 8.5,55.5 12.5,54 12.5,51 13.5,47.5 11.5,47.5 10.5,47.5 16,49.5 18.5,53.5 18.5,54.5 18.5,56.5 9.5,53 8.5,54 7.5,50 9.5,50 14.5,47.5 18,49.5 19.63,57.8 37,73.5 34.75,47.8 34.73,45.18 9,33.5 6,33.5 6,36.5 9,36.5 12,36.5 15,36.5 15,33 13,33 10.5,33 3,33 3,37 18,36.5 22,36.5 24,36.5 29,37 29,33 23,33 27,36.5 27,33 19.5,33 19.5,28 19.5,31 19.5,30 5.5,29 5.5,27 2.5,29 2.5,27 2.5,24 2.5,21 2.5,18 2.5,15 2.5,12 2.5,9 6,7.5 4,7.5 8,7 10,7 12,7 15,7.5 16.5,9 16.5,12 13.5,12 13.5,10.5 12,10.5 9,10.5 7,10.5 6,12 6,15 6,18 6,19.5 9,19.5 11.5,21 11.5,23 11,20 10,23 7,23 5.5,23 5.5,25 13.5,15 16.5,15 16.5,17 13.5,17 12,60.5 9,60.5 36.64,80.64 37.48,80.61 38.37,80.61 39.23,80.61 40.12,80.61 58,60 58,57 58,54 58,51 58,48 58,45 57,43 59,45 59,48 59,51 59,43 59,54 59,57 59,60 59,63 59,66.5 60.5,66.5 62,62.5 62,66 63,62.5 64.5,62.5 65.5,62.5 62,64 63,58.5 65,58.5 66.5,60 62,57 64,55.5 64,54.5 64,52.5 64,51.5 62,50 62,53.5 62,48 63.5,47.5 66,47 65.5,43.5 64.5,43.5 63,43.6 62,43.5 62,42 53.37,40.06 52.14,43.56 53.22,45.26 53.37,46.56 53.37,47.56 53.37,49.06 53.37,50.06 53,51.5 53,54 52.5,56 50.37,57.56 51.37,59.56 52.37,59.56 53.87,59.56 54.87,59.56 54.87,61.06 54.87,62.56 52.87,64.36 50.47,65.16 47.87,67.06 46.87,69.06 45.87,72.06 44.37,75.06 44.37,78.06 44.37,81.06 44.37,84.06 44,87 47,87 47,84 47,81 47,78 48,77 48.5,75 48.6,72 49.5,70.5 52,68 53.6,66.7 46,89 44.5,90.5 49.8,43.1 47.5,43.1 45.1,43.1 42.47,40.86 49.78,40.67 22.6,88.2 29.6,88.5 56,80 53,77.7 47.5,45 45.5,46.5 45.72,47.98 45.72,50.98 48.22,50.98 48.22,47.98 45.72,53.98 48.22,53.98 48.2,57 45.7,57 44.6,59.2 48,58.7 46.7,60.5 45,61.9 42.65,60.11 42.8,62.6 39.8,66 39.8,69 39.7,72 42.3,72 42.3,66 41.5,74 38.1,76.5 61.99,40.18 23,30.5 21.5,27 23,28
  pour Top (no thermals): 0,99.64 0,36 77,36 77,99.64
  pour Bottom (no thermals): 0,99.64 0,0 77,0 77,99.64
  pour Top: 0,0 0,36 77,36 77,0
LNA-BYPASS
  Top 0.406: 42.16,61.37 arc90 42.16,61.38 SW_LNA-OUT.3
  Top 0.508: SW_LNA-IN.3 arc-90 SW_LNA-IN.3 42.07,44.98 arc90 42.55,44.5 44,44.5 44.02,44.5
  Top 1: 44,44.5 arc90 47,47.5 47,56.53 arc90 42.16,61.37
LNA-IN
  Top 0.508: Q5.4 43.53,50.8 43.15,51.18 R2.2 43.43,50.98 43.43,49.53 43.78,49.18 C8.P$2 42.04,49.18 R1.1
LNA-OUT
  Top 0.508: C12.P$1 42.38,57.97 Q5.2 39.44,55.73 | R3.1 37.36,55.73 39.37,55.73 39.44,55.73 | C9.P$2 39.44,55.73
LNA_ON  (via drill 0.2, 0.35)
  Top 0.406: SW_LNA-OUT.4 v42.05,63.48 | SW_LNA-IN.4 42.06,43.44 v41.68,43.44 | TP-LNA-ON.TP 35.46,32.23 v32.77,32.23 32.84,32.16 Q4.4
  Bottom 0.406: v42.05,63.48 36.33,63.48 32.77,59.92 32.77,43.43 | Q6.3 65.42,10.15 58.22,17.35 46.5,17.35 40.44,17.35 32.77,25.02 v32.77,32.23 32.77,43.43 | v41.68,43.44 32.77,43.44 32.77,43.43
  other vias: 67.75,10.1
N$1
  Top 0.508: SW_LNA-OUT.1 40.36,58.18 C12.P$2
N$2
  Top 1.5: 36.78,82.27 39.98,82.27
N$3
  Top 0.508: SW_LNA-IN.1 43.37,47.17 43.57,47.38 C8.P$1
N$4
  Top 0.406: C23.P$2 59.25,13.1 Q3.4
N$5
  Bottom 1: L18.P$2 L13.P$1
N$6
  Bottom 1: X2A.3 L15.P$1
N$7
  Top 0.406: Q2.5 Q2.6
N$8
  Bottom 1.016: 41.6,9.87 41.6,8.96 41.94,8.62 X7.2 | 41.6,9.87 X7.3 | X7.1 42.96,11.33 41.9,11.33 41.6,11.04 41.6,9.87
N$9
  Bottom 1.016: R11.1 47.6,10 | 47.6,10 R16.1 | X8.3 47.6,10
N$10
  Bottom 1.016: R11.2 52.38,12.5 X8.1 53.54,11.33 54.6,11.33 54.9,11.04 54.9,8.96 54.6,8.67 53.54,8.67 X8.2 52.38,7.5 R16.2
N$11
  Bottom 1: L14.P$2 X2B.3
N$12
  Top 0.406: FB5.P$1 68.9,31.5 R18.1
N$13
  Top 0.406: F1.1 55.72,6.04
  Top 0.61: 55.72,6.04 FB1.P$1
N$14
  Bottom 1: X9.3 X10.3
N$22
  Top 0.508: C9.P$1 39.88,53.49 39.88,51.31 40.31,51.31 R2.1
N$27
  Top 0.406: 63.85,18.07 R5.1 64,19 FB2.P$1
N$28
  Top 0.406: FB3.P$1 29.62,5.58 R6.1
N$32
  Top 0.406: FB4.P$1 35.1,9.76 R7.1
N$45
  Top 0.406: R12.1 24.5,26.69 FB6.P$1
RADIO  (2 unrouted)
  Top 1.5: X2.1 25.16,78.5 | 25.07,78.49 25.4,78.49
  Top 2: X2.1
RADIO_TX
  Top 0.4: 29.34,17.34 R13.1
  Top 0.406: T1.C 28.94,17.42 | Q1.1 31.5,17.24 | 31.5,17.24 29.44,17.24 29.34,17.34 | 31.5,17.24 31.5,19.25 TP-RADIO-TX.TP
  Top 0.5: 28.94,17.42 R13.1
RELAY-RX_ON  (via drill 0.2, 0.4)
  Top 0.406: TP-RLY-ON.TP | 53.8,18.95 58.72,18.95 FB2.P$2 | TP-RLY-ON.TP 53.8,18.95 | 53.8,18.95 53.8,16.3 53.5,16 46.23,16 45.85,16.38 Q2.3
  Bottom 0.406: TP-RLY-ON.TP 53.8,23.29 68.3,37.79 68.3,62.93 55.91,75.32 R9.1 68.97,75.32 74.42,80.77 74.42,89.92 66.04,98.3 33.02,98.3 30.08,95.36 R10.2
  other vias: 30.08,92.17 53.31,75.32 53.8,22.58
RELAY-TO-RELAY_RF
  Top 0.9: RL2.20 36.5,82.31 37.01,82.31 | 37.01,82.31 37.5,82.3 39.5,82.3 | 39.5,82.3 40.49,82.29 RL1.20 | 37.01,82.31 | 39.5,82.3
SEL_BPF_VHF  (via drill 0.2)
  Top 0.152: R17.1 52.3,31.98 52.36,32.04
  Top 0.254: v55.15,66.54 SW_BPF-IN.4
  Top 0.406: SW_BPF-OUT.4 51.98,42.52 52.3,42.2 52.3,32.1 52.36,32.04 53.08,31.32 v59.7,31.32 | v59.7,31.32 TP-VHF-ON.TP | FB5.P$2 59.88,31.5 v59.7,31.32
  Bottom 0.406: v55.15,66.54 57.03,68.42 61.63,68.42 67.43,62.63 67.43,38.94 59.88,31.39 59.77,31.39 v59.7,31.32
T-U-IN
  Bottom 1: X3A.3 C40.P$1
T-U-OUT
  Bottom 1: X3B.3 C46.P$1
T-U-P1
  Bottom 1: C40.P$2 4,21 | 4,21 C42.P$1 | 4,21 6.9,21 C41.P$1 L6.P$1
T-U-P2
  Bottom 1: C42.P$2 4.1,18 C43.P$1 L8.P$1 C44.P$1
T-U-P3
  Bottom 1: C44.P$2 8.9,9 C45.P$1 L9.P$1 14.8,8.9 C46.P$2
T-V-P1
  Bottom 1: L15.P$2 8.5,34.9 L16.P$1 C31.P$2 15.5,34.9 L18.P$1
T-V-P2
  Bottom 1: L14.P$1 L13.P$2 C32.P$2 L17.P$1
TO_BPF
  Top 1: R8.2 38.27,90.05 arc-90 D1.2 arc90 38.25,89.91 RL1.14 arc-90 45.58,85.95 C25.P$2
TX_GND_IN
  Top 0.406: C15.P$2 R6.2 27.84,4.56 TX_GND.1
TX_INH_OUT
  Top 0.406: TX_INH.1 73.17,18.61 70.41,18.61
  Top 0.508: R5.2 70.41,18.61 C14.P$2
UHF-IN
  Top 0.406: SW_BPF-IN.3 56.88,66.15 arc90 56.21,65.48 56.21,63.01 C33.P$1
UHF-OUT
  Top 0.152: SW_BPF-OUT.3 arc90 SW_BPF-OUT.3 53.31,43.05 53.31,43.33 arc-90 54.36,44.37 C35.P$2
  Top 1: C35.P$2 54.63,44.37 arc90 53.31,43.05
UHF-P1
  Top 1: C6.P$2 L10.P$1 56.51,57.47 | C33.P$2 56.55,57.5 56.51,57.47 | C47.P$1 56.51,54.91 56.51,57.47
UHF-P2
  Top 1: C35.P$1 56.53,47 | 56.53,47 56.53,49.5 | C7.P$2 56.45,46.92 56.53,47 | L11.P$1 56.35,49.68 56.53,49.5 | 56.53,49.5 56.53,53.06 C47.P$2
VHF-IN
  Top 0.2: 58.15,64.86 SW_BPF-IN.1
  Top 1: C1.P$2 58.15,64.86
VHF-OUT
  Top 0.406: SW_BPF-OUT.1 54.38,41.23
  Top 1: C5.P$2 54.38,41.23
VHF-P1
  Top 1: C1.P$1 60.6,60 | 60.6,60 60.6,58.47 C36.P$2 | L1.P$2 C2.P$1 60.61,59.99 60.6,60
VHF-P3  (1 unrouted)
  Top 1: 60.5,47 | 60.5,47 C37.P$1 | 60.5,47 60.5,46 | 60.5,46 60.5,43 C5.P$1 | 60.5,46 C4.P$1 L3.P$1
VHF_ON_IN
  Top 0.406: VHF.1 69.17,25.07 C19.P$2 R18.2
VPF-P2
  Top 1: C36.P$1 60.5,55 | 60.5,55 60.5,52 | 60.5,52 C37.P$2 | L2.P$2 60.5,52 | C3.P$1 60.5,55

### Text on the board
Top: 1
Bottom: 0
tPlace: STATIC&SURGE / MITIGATION | 2 | github.com/rfrht/SignalSurge | ALL FLAWS BY: | BPF VHF/UHF | Rev.: | Sept / 2026 | LNA | SignalSurge by PY2RAF | UHF | VHF | LNA CTRL | 5V | 12V | RELAY / CTRL | Gordon Brown, AD5GG / r/rfelectronics / r/AskElectronics | THANK YOUS: | VOLT. / REGUL. | Rev.: / Date: | 3V | GND | 5V
bPlace: By: | github.com/rfrht/SignalSurge | FILTER | All flaws by: / PY2RAF | 144 MHz Bandpass filter | 2-pole | T2 | T1 | U.FL CALIBRATION KIT | 3-pole | O | S | L
tStop: 3
tRestrict: 4